# Altium schematic sheet Connector.SchDoc
size D
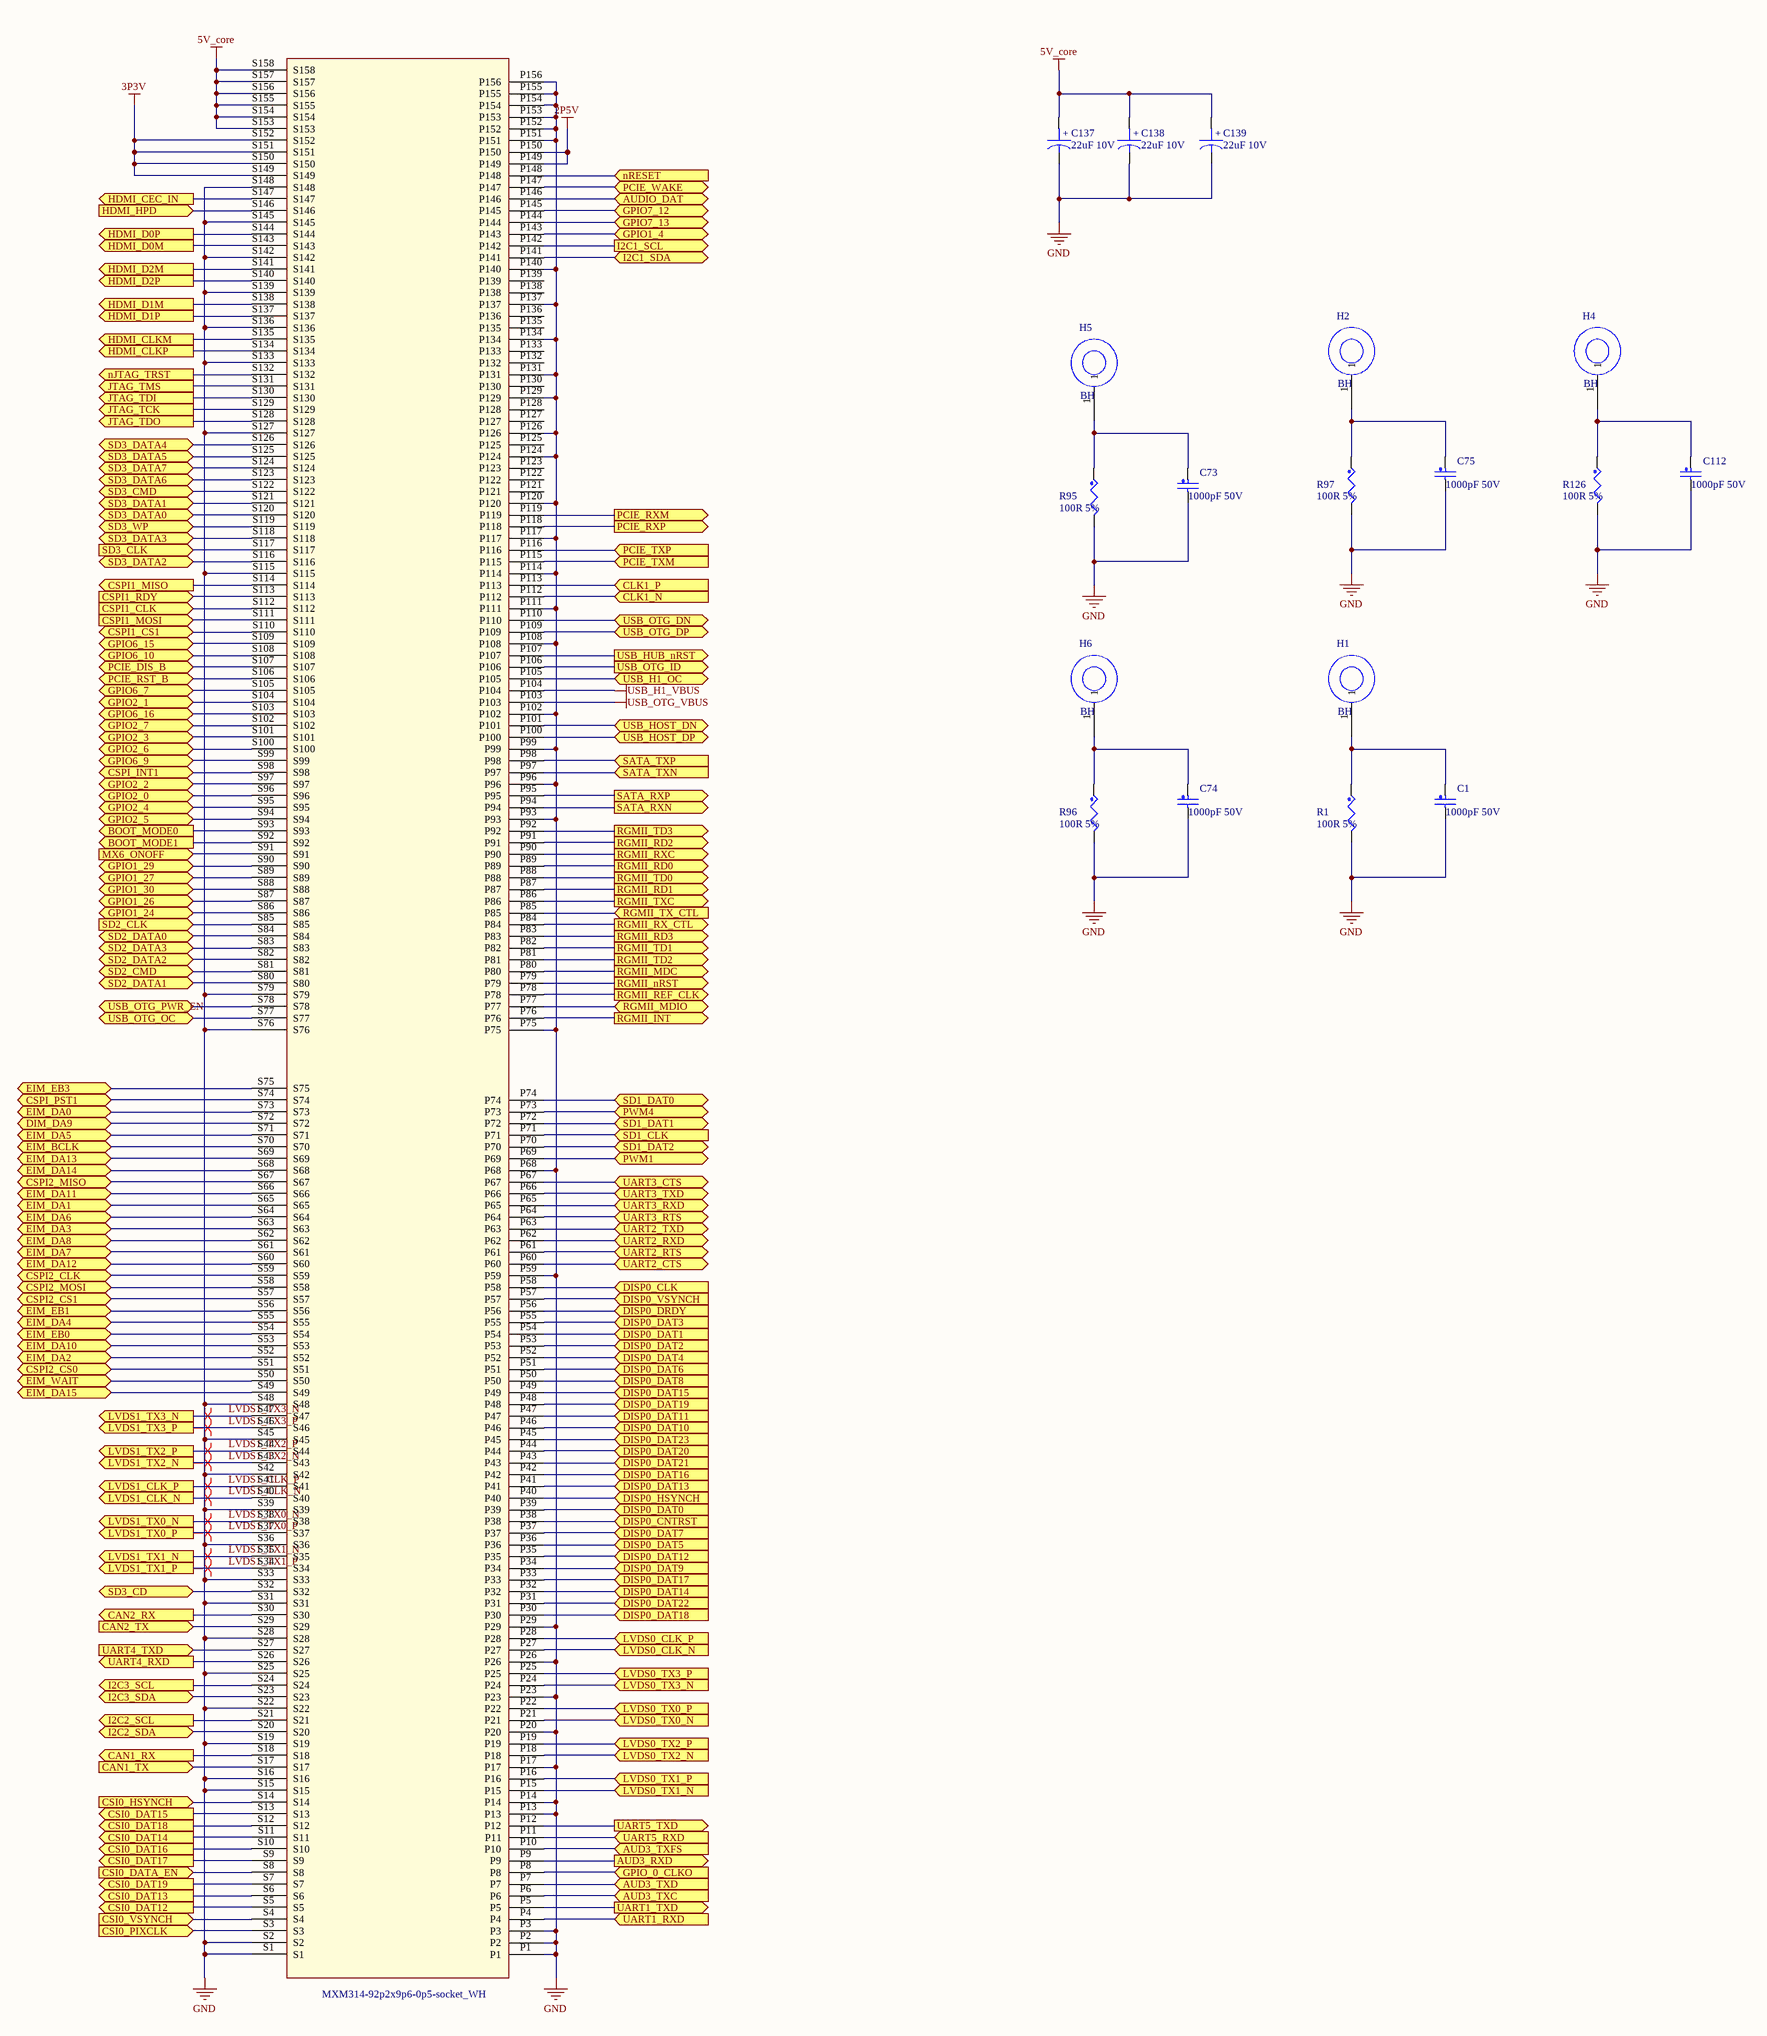
[diagram p0: Connector.SchDoc]

## Parts
C1  1000pF 50V  [SC0603]
C73  1000pF 50V  [SC0603]
C74  1000pF 50V  [SC0603]
C75  1000pF 50V  [SC0603]
C112  1000pF 50V  [SC0603]
C137  22uF 10V  [SC0805]
C138  22uF 10V  [SC0805]
C139  22uF 10V  [SC0805]
H1  BH  [H30]
H2  BH  [H30]
H4  BH  [H30]
H5  BH  [H30]
H6  BH  [H30]
MXM314-92p2x9p6-0p5-socket_WH  MXM314-92p2x9p6-0p5-socket_WH  [MXM314-92P2X9P6-0P5-SOCKET_WH]  (value not drawn)
R1  100R 5%  [SR0603]
R95  100R 5%  [SR0603]
R96  100R 5%  [SR0603]
R97  100R 5%  [SR0603]
R126  100R 5%  [SR0603]

## Ports
AUD3_RXD (out), AUD3_TXC (in), AUD3_TXD (in), AUD3_TXFS (in), AUDIO_DAT (bidir), BOOT_MODE0 (out), BOOT_MODE1 (out), CAN1_RX (out), CAN1_TX (in), CAN2_RX (out), CAN2_TX (in), CLK1_N (in), CLK1_P (in), CSI0_DAT12 (out), CSI0_DAT13 (out), CSI0_DAT14 (out), CSI0_DAT15 (out), CSI0_DAT16 (out), CSI0_DAT17 (out), CSI0_DAT18 (out), CSI0_DAT19 (out), CSI0_DATA_EN (in), CSI0_HSYNCH (in), CSI0_PIXCLK (in), CSI0_VSYNCH (in), CSPI1_CLK (in), CSPI1_CS1 (bidir), CSPI1_MISO (out), CSPI1_MOSI (in), CSPI1_RDY (in), CSPI2_CLK (bidir), CSPI2_CS0 (bidir), CSPI2_CS1 (bidir), CSPI2_MISO (bidir), CSPI2_MOSI (bidir), CSPI_INT1 (bidir), CSPI_PST1 (bidir), DIM_DA9 (bidir), DISP0_CLK (in), DISP0_CNTRST (in), DISP0_DAT0 (in), DISP0_DAT1 (in), DISP0_DAT2 (in), DISP0_DAT3 (in), DISP0_DAT4 (in), DISP0_DAT5 (in), DISP0_DAT6 (in), DISP0_DAT7 (in), DISP0_DAT8 (in), DISP0_DAT9 (in), DISP0_DAT10 (in), DISP0_DAT11 (in), DISP0_DAT12 (in), DISP0_DAT13 (in), DISP0_DAT14 (in), DISP0_DAT15 (in), DISP0_DAT16 (in), DISP0_DAT17 (in), DISP0_DAT18 (in), DISP0_DAT19 (in), DISP0_DAT20 (in), DISP0_DAT21 (in), DISP0_DAT22 (in), DISP0_DAT23 (in), DISP0_DRDY (in), DISP0_HSYNCH (in), DISP0_VSYNCH (in), EIM_BCLK (bidir), EIM_DA0 (bidir), EIM_DA1 (bidir), EIM_DA2 (bidir), EIM_DA3 (bidir), EIM_DA4 (bidir), EIM_DA5 (bidir), EIM_DA6 (bidir), EIM_DA7 (bidir), EIM_DA8 (bidir), EIM_DA10 (bidir), EIM_DA11 (bidir), EIM_DA12 (bidir), EIM_DA13 (bidir), EIM_DA14 (bidir), EIM_DA15 (bidir), EIM_EB0 (bidir), EIM_EB1 (bidir), EIM_EB3 (bidir), EIM_WAIT (bidir), GPIO1_4 (bidir), GPIO1_24 (bidir), GPIO1_26 (bidir), GPIO1_27 (bidir), GPIO1_29 (bidir), GPIO1_30 (bidir), GPIO2_0 (bidir), GPIO2_1 (bidir), GPIO2_2 (bidir), GPIO2_3 (bidir), GPIO2_4 (bidir), GPIO2_5 (bidir), GPIO2_6 (bidir), GPIO2_7 (bidir), GPIO6_7 (bidir), GPIO6_9 (bidir), GPIO6_10 (bidir), GPIO6_15 (bidir), GPIO6_16 (bidir), GPIO7_12 (bidir), GPIO7_13 (bidir), GPIO_0_CLKO (in), HDMI_CEC_IN (out), HDMI_CLKM (out), HDMI_CLKP (out), HDMI_D0M (out), HDMI_D0P (out), HDMI_D1M (out), HDMI_D1P (out), HDMI_D2M (out), HDMI_D2P (out), HDMI_HPD (in), I2C1_SCL (out), I2C1_SDA (bidir), I2C2_SCL (out), I2C2_SDA (bidir), I2C3_SCL (out), I2C3_SDA (bidir), JTAG_TCK (out), JTAG_TDI (out), JTAG_TDO (out), JTAG_TMS (out), LVDS0_CLK_N (in), LVDS0_CLK_P (in), LVDS0_TX0_N (in), LVDS0_TX0_P (in), LVDS0_TX1_N (in), LVDS0_TX1_P (in), LVDS0_TX2_N (in), LVDS0_TX2_P (in), LVDS0_TX3_N (in), LVDS0_TX3_P (in), LVDS1_CLK_N (out), LVDS1_CLK_P (out), LVDS1_TX0_N (out), LVDS1_TX0_P (out), LVDS1_TX1_N (out), LVDS1_TX1_P (out), LVDS1_TX2_N (out), LVDS1_TX2_P (out), LVDS1_TX3_N (out), LVDS1_TX3_P (out), MX6_ONOFF (in), nJTAG_TRST (out), nRESET (in), PCIE_DIS_B (bidir), PCIE_RST_B (bidir), PCIE_RXM (out), PCIE_RXP (out), PCIE_TXM (in), PCIE_TXP (in), PCIE_WAKE (bidir), PWM1 (bidir), PWM4 (bidir), RGMII_INT (out), RGMII_MDC (out), RGMII_MDIO (bidir), RGMII_nRST (out), RGMII_RD0 (out), RGMII_RD1 (out), RGMII_RD2 (out), RGMII_RD3 (out), RGMII_REF_CLK (out), RGMII_RX_CTL (out), RGMII_RXC (out), RGMII_TD0 (out), RGMII_TD1 (out), RGMII_TD2 (out), RGMII_TD3 (out), RGMII_TX_CTL (in), RGMII_TXC (out), SATA_RXN (out), SATA_RXP (out), SATA_TXN (in), SATA_TXP (in), SD1_CLK (in), SD1_DAT0 (bidir), SD1_DAT1 (bidir), SD1_DAT2 (bidir), SD2_CLK (in), SD2_CMD (bidir), SD2_DATA0 (bidir), SD2_DATA1 (bidir), SD2_DATA2 (bidir), SD2_DATA3 (bidir), SD3_CD (bidir), SD3_CLK (in), SD3_CMD (bidir), SD3_DATA0 (bidir), SD3_DATA1 (bidir), SD3_DATA2 (bidir), SD3_DATA3 (bidir), SD3_DATA4 (bidir), SD3_DATA5 (bidir), SD3_DATA6 (bidir), SD3_DATA7 (bidir), SD3_WP (bidir), UART1_RXD (in), UART1_TXD (out), UART2_CTS (bidir), UART2_RTS (bidir), UART2_RXD (bidir), UART2_TXD (bidir), UART3_CTS (bidir), UART3_RTS (bidir), UART3_RXD (bidir), UART3_TXD (bidir), UART4_RXD (out), UART4_TXD (in), UART5_RXD (in), UART5_TXD (out), USB_H1_OC (bidir), USB_HOST_DN (bidir), USB_HOST_DP (bidir), USB_HUB_nRST (out), USB_OTG_DN (bidir), USB_OTG_DP (bidir), USB_OTG_ID (out), USB_OTG_OC (bidir), USB_OTG_PWR_EN (bidir)

## Nets
2P5V: MXM314-92p2x9p6-0p5-socket_WH.P149 MXM314-92p2x9p6-0p5-socket_WH.P150
3P3V: MXM314-92p2x9p6-0p5-socket_WH.S149 MXM314-92p2x9p6-0p5-socket_WH.S150 MXM314-92p2x9p6-0p5-socket_WH.S151 MXM314-92p2x9p6-0p5-socket_WH.S152
5V_core: C137.1 C138.1 C139.1 MXM314-92p2x9p6-0p5-socket_WH.S153 MXM314-92p2x9p6-0p5-socket_WH.S154 MXM314-92p2x9p6-0p5-socket_WH.S155 MXM314-92p2x9p6-0p5-socket_WH.S156 MXM314-92p2x9p6-0p5-socket_WH.S157 MXM314-92p2x9p6-0p5-socket_WH.S158
GND: C1.2 C73.2 C74.2 C75.2 C112.2 C137.2 C138.2 C139.2 MXM314-92p2x9p6-0p5-socket_WH.P1 MXM314-92p2x9p6-0p5-socket_WH.P2 MXM314-92p2x9p6-0p5-socket_WH.P3 MXM314-92p2x9p6-0p5-socket_WH.P13 MXM314-92p2x9p6-0p5-socket_WH.P14 MXM314-92p2x9p6-0p5-socket_WH.P17 MXM314-92p2x9p6-0p5-socket_WH.P20 MXM314-92p2x9p6-0p5-socket_WH.P23 MXM314-92p2x9p6-0p5-socket_WH.P26 MXM314-92p2x9p6-0p5-socket_WH.P29 MXM314-92p2x9p6-0p5-socket_WH.P59 MXM314-92p2x9p6-0p5-socket_WH.P68 MXM314-92p2x9p6-0p5-socket_WH.P75 MXM314-92p2x9p6-0p5-socket_WH.P93 MXM314-92p2x9p6-0p5-socket_WH.P96 MXM314-92p2x9p6-0p5-socket_WH.P99 MXM314-92p2x9p6-0p5-socket_WH.P102 MXM314-92p2x9p6-0p5-socket_WH.P108 MXM314-92p2x9p6-0p5-socket_WH.P111 MXM314-92p2x9p6-0p5-socket_WH.P114 MXM314-92p2x9p6-0p5-socket_WH.P117 MXM314-92p2x9p6-0p5-socket_WH.P120 MXM314-92p2x9p6-0p5-socket_WH.P124 MXM314-92p2x9p6-0p5-socket_WH.P126 MXM314-92p2x9p6-0p5-socket_WH.P129 MXM314-92p2x9p6-0p5-socket_WH.P131 MXM314-92p2x9p6-0p5-socket_WH.P134 MXM314-92p2x9p6-0p5-socket_WH.P137 MXM314-92p2x9p6-0p5-socket_WH.P140 MXM314-92p2x9p6-0p5-socket_WH.P151 MXM314-92p2x9p6-0p5-socket_WH.P152 MXM314-92p2x9p6-0p5-socket_WH.P153 MXM314-92p2x9p6-0p5-socket_WH.P154 MXM314-92p2x9p6-0p5-socket_WH.P155 MXM314-92p2x9p6-0p5-socket_WH.P156 MXM314-92p2x9p6-0p5-socket_WH.S1 MXM314-92p2x9p6-0p5-socket_WH.S2 MXM314-92p2x9p6-0p5-socket_WH.S15 MXM314-92p2x9p6-0p5-socket_WH.S16 MXM314-92p2x9p6-0p5-socket_WH.S19 MXM314-92p2x9p6-0p5-socket_WH.S22 MXM314-92p2x9p6-0p5-socket_WH.S25 MXM314-92p2x9p6-0p5-socket_WH.S28 MXM314-92p2x9p6-0p5-socket_WH.S31 MXM314-92p2x9p6-0p5-socket_WH.S33 MXM314-92p2x9p6-0p5-socket_WH.S36 MXM314-92p2x9p6-0p5-socket_WH.S39 MXM314-92p2x9p6-0p5-socket_WH.S42 MXM314-92p2x9p6-0p5-socket_WH.S45 MXM314-92p2x9p6-0p5-socket_WH.S48 MXM314-92p2x9p6-0p5-socket_WH.S76 MXM314-92p2x9p6-0p5-socket_WH.S79 MXM314-92p2x9p6-0p5-socket_WH.S115 MXM314-92p2x9p6-0p5-socket_WH.S127 MXM314-92p2x9p6-0p5-socket_WH.S133 MXM314-92p2x9p6-0p5-socket_WH.S136 MXM314-92p2x9p6-0p5-socket_WH.S139 MXM314-92p2x9p6-0p5-socket_WH.S142 MXM314-92p2x9p6-0p5-socket_WH.S145 MXM314-92p2x9p6-0p5-socket_WH.S148 R1.2 R95.2 R96.2 R97.2 R126.2
USB_H1_VBUS: MXM314-92p2x9p6-0p5-socket_WH.P104
USB_OTG_VBUS: MXM314-92p2x9p6-0p5-socket_WH.P103
AUD3_RXD: MXM314-92p2x9p6-0p5-socket_WH.P9 ; port AUD3_RXD
AUD3_TXC: MXM314-92p2x9p6-0p5-socket_WH.P6 ; port AUD3_TXC
AUD3_TXD: MXM314-92p2x9p6-0p5-socket_WH.P7 ; port AUD3_TXD
AUD3_TXFS: MXM314-92p2x9p6-0p5-socket_WH.P10 ; port AUD3_TXFS
AUDIO_DAT: MXM314-92p2x9p6-0p5-socket_WH.P146 ; port AUDIO_DAT
BOOT_MODE0: MXM314-92p2x9p6-0p5-socket_WH.S93 ; port BOOT_MODE0
BOOT_MODE1: MXM314-92p2x9p6-0p5-socket_WH.S92 ; port BOOT_MODE1
CAN1_RX: MXM314-92p2x9p6-0p5-socket_WH.S18 ; port CAN1_RX
CAN1_TX: MXM314-92p2x9p6-0p5-socket_WH.S17 ; port CAN1_TX
CAN2_RX: MXM314-92p2x9p6-0p5-socket_WH.S30 ; port CAN2_RX
CAN2_TX: MXM314-92p2x9p6-0p5-socket_WH.S29 ; port CAN2_TX
CLK1_N: MXM314-92p2x9p6-0p5-socket_WH.P112 ; port CLK1_N
CLK1_P: MXM314-92p2x9p6-0p5-socket_WH.P113 ; port CLK1_P
CSI0_DAT12: MXM314-92p2x9p6-0p5-socket_WH.S5 ; port CSI0_DAT12
CSI0_DAT13: MXM314-92p2x9p6-0p5-socket_WH.S6 ; port CSI0_DAT13
CSI0_DAT14: MXM314-92p2x9p6-0p5-socket_WH.S11 ; port CSI0_DAT14
CSI0_DAT15: MXM314-92p2x9p6-0p5-socket_WH.S13 ; port CSI0_DAT15
CSI0_DAT16: MXM314-92p2x9p6-0p5-socket_WH.S10 ; port CSI0_DAT16
CSI0_DAT17: MXM314-92p2x9p6-0p5-socket_WH.S9 ; port CSI0_DAT17
CSI0_DAT18: MXM314-92p2x9p6-0p5-socket_WH.S12 ; port CSI0_DAT18
CSI0_DAT19: MXM314-92p2x9p6-0p5-socket_WH.S7 ; port CSI0_DAT19
CSI0_DATA_EN: MXM314-92p2x9p6-0p5-socket_WH.S8 ; port CSI0_DATA_EN
CSI0_HSYNCH: MXM314-92p2x9p6-0p5-socket_WH.S14 ; port CSI0_HSYNCH
CSI0_PIXCLK: MXM314-92p2x9p6-0p5-socket_WH.S3 ; port CSI0_PIXCLK
CSI0_VSYNCH: MXM314-92p2x9p6-0p5-socket_WH.S4 ; port CSI0_VSYNCH
CSPI1_CLK: MXM314-92p2x9p6-0p5-socket_WH.S112 ; port CSPI1_CLK
CSPI1_CS1: MXM314-92p2x9p6-0p5-socket_WH.S110 ; port CSPI1_CS1
CSPI1_MISO: MXM314-92p2x9p6-0p5-socket_WH.S114 ; port CSPI1_MISO
CSPI1_MOSI: MXM314-92p2x9p6-0p5-socket_WH.S111 ; port CSPI1_MOSI
CSPI1_RDY: MXM314-92p2x9p6-0p5-socket_WH.S113 ; port CSPI1_RDY
CSPI2_CLK: MXM314-92p2x9p6-0p5-socket_WH.S59 ; port CSPI2_CLK
CSPI2_CS0: MXM314-92p2x9p6-0p5-socket_WH.S51 ; port CSPI2_CS0
CSPI2_CS1: MXM314-92p2x9p6-0p5-socket_WH.S57 ; port CSPI2_CS1
CSPI2_MISO: MXM314-92p2x9p6-0p5-socket_WH.S67 ; port CSPI2_MISO
CSPI2_MOSI: MXM314-92p2x9p6-0p5-socket_WH.S58 ; port CSPI2_MOSI
CSPI_INT1: MXM314-92p2x9p6-0p5-socket_WH.S98 ; port CSPI_INT1
CSPI_PST1: MXM314-92p2x9p6-0p5-socket_WH.S74 ; port CSPI_PST1
DIM_DA9: MXM314-92p2x9p6-0p5-socket_WH.S72 ; port DIM_DA9
DISP0_CLK: MXM314-92p2x9p6-0p5-socket_WH.P58 ; port DISP0_CLK
DISP0_CNTRST: MXM314-92p2x9p6-0p5-socket_WH.P38 ; port DISP0_CNTRST
DISP0_DAT0: MXM314-92p2x9p6-0p5-socket_WH.P39 ; port DISP0_DAT0
DISP0_DAT1: MXM314-92p2x9p6-0p5-socket_WH.P54 ; port DISP0_DAT1
DISP0_DAT2: MXM314-92p2x9p6-0p5-socket_WH.P53 ; port DISP0_DAT2
DISP0_DAT3: MXM314-92p2x9p6-0p5-socket_WH.P55 ; port DISP0_DAT3
DISP0_DAT4: MXM314-92p2x9p6-0p5-socket_WH.P52 ; port DISP0_DAT4
DISP0_DAT5: MXM314-92p2x9p6-0p5-socket_WH.P36 ; port DISP0_DAT5
DISP0_DAT6: MXM314-92p2x9p6-0p5-socket_WH.P51 ; port DISP0_DAT6
DISP0_DAT7: MXM314-92p2x9p6-0p5-socket_WH.P37 ; port DISP0_DAT7
DISP0_DAT8: MXM314-92p2x9p6-0p5-socket_WH.P50 ; port DISP0_DAT8
DISP0_DAT9: MXM314-92p2x9p6-0p5-socket_WH.P34 ; port DISP0_DAT9
DISP0_DAT10: MXM314-92p2x9p6-0p5-socket_WH.P46 ; port DISP0_DAT10
DISP0_DAT11: MXM314-92p2x9p6-0p5-socket_WH.P47 ; port DISP0_DAT11
DISP0_DAT12: MXM314-92p2x9p6-0p5-socket_WH.P35 ; port DISP0_DAT12
DISP0_DAT13: MXM314-92p2x9p6-0p5-socket_WH.P41 ; port DISP0_DAT13
DISP0_DAT14: MXM314-92p2x9p6-0p5-socket_WH.P32 ; port DISP0_DAT14
DISP0_DAT15: MXM314-92p2x9p6-0p5-socket_WH.P49 ; port DISP0_DAT15
DISP0_DAT16: MXM314-92p2x9p6-0p5-socket_WH.P42 ; port DISP0_DAT16
DISP0_DAT17: MXM314-92p2x9p6-0p5-socket_WH.P33 ; port DISP0_DAT17
DISP0_DAT18: MXM314-92p2x9p6-0p5-socket_WH.P30 ; port DISP0_DAT18
DISP0_DAT19: MXM314-92p2x9p6-0p5-socket_WH.P48 ; port DISP0_DAT19
DISP0_DAT20: MXM314-92p2x9p6-0p5-socket_WH.P44 ; port DISP0_DAT20
DISP0_DAT21: MXM314-92p2x9p6-0p5-socket_WH.P43 ; port DISP0_DAT21
DISP0_DAT22: MXM314-92p2x9p6-0p5-socket_WH.P31 ; port DISP0_DAT22
DISP0_DAT23: MXM314-92p2x9p6-0p5-socket_WH.P45 ; port DISP0_DAT23
DISP0_DRDY: MXM314-92p2x9p6-0p5-socket_WH.P56 ; port DISP0_DRDY
DISP0_HSYNCH: MXM314-92p2x9p6-0p5-socket_WH.P40 ; port DISP0_HSYNCH
DISP0_VSYNCH: MXM314-92p2x9p6-0p5-socket_WH.P57 ; port DISP0_VSYNCH
EIM_BCLK: MXM314-92p2x9p6-0p5-socket_WH.S70 ; port EIM_BCLK
EIM_DA0: MXM314-92p2x9p6-0p5-socket_WH.S73 ; port EIM_DA0
EIM_DA1: MXM314-92p2x9p6-0p5-socket_WH.S65 ; port EIM_DA1
EIM_DA2: MXM314-92p2x9p6-0p5-socket_WH.S52 ; port EIM_DA2
EIM_DA3: MXM314-92p2x9p6-0p5-socket_WH.S63 ; port EIM_DA3
EIM_DA4: MXM314-92p2x9p6-0p5-socket_WH.S55 ; port EIM_DA4
EIM_DA5: MXM314-92p2x9p6-0p5-socket_WH.S71 ; port EIM_DA5
EIM_DA6: MXM314-92p2x9p6-0p5-socket_WH.S64 ; port EIM_DA6
EIM_DA7: MXM314-92p2x9p6-0p5-socket_WH.S61 ; port EIM_DA7
EIM_DA8: MXM314-92p2x9p6-0p5-socket_WH.S62 ; port EIM_DA8
EIM_DA10: MXM314-92p2x9p6-0p5-socket_WH.S53 ; port EIM_DA10
EIM_DA11: MXM314-92p2x9p6-0p5-socket_WH.S66 ; port EIM_DA11
EIM_DA12: MXM314-92p2x9p6-0p5-socket_WH.S60 ; port EIM_DA12
EIM_DA13: MXM314-92p2x9p6-0p5-socket_WH.S69 ; port EIM_DA13
EIM_DA14: MXM314-92p2x9p6-0p5-socket_WH.S68 ; port EIM_DA14
EIM_DA15: MXM314-92p2x9p6-0p5-socket_WH.S49 ; port EIM_DA15
EIM_EB0: MXM314-92p2x9p6-0p5-socket_WH.S54 ; port EIM_EB0
EIM_EB1: MXM314-92p2x9p6-0p5-socket_WH.S56 ; port EIM_EB1
EIM_EB3: MXM314-92p2x9p6-0p5-socket_WH.S75 ; port EIM_EB3
EIM_WAIT: MXM314-92p2x9p6-0p5-socket_WH.S50 ; port EIM_WAIT
GPIO1_4: MXM314-92p2x9p6-0p5-socket_WH.P143 ; port GPIO1_4
GPIO1_24: MXM314-92p2x9p6-0p5-socket_WH.S86 ; port GPIO1_24
GPIO1_26: MXM314-92p2x9p6-0p5-socket_WH.S87 ; port GPIO1_26
GPIO1_27: MXM314-92p2x9p6-0p5-socket_WH.S89 ; port GPIO1_27
GPIO1_29: MXM314-92p2x9p6-0p5-socket_WH.S90 ; port GPIO1_29
GPIO1_30: MXM314-92p2x9p6-0p5-socket_WH.S88 ; port GPIO1_30
GPIO2_0: MXM314-92p2x9p6-0p5-socket_WH.S96 ; port GPIO2_0
GPIO2_1: MXM314-92p2x9p6-0p5-socket_WH.S104 ; port GPIO2_1
GPIO2_2: MXM314-92p2x9p6-0p5-socket_WH.S97 ; port GPIO2_2
GPIO2_3: MXM314-92p2x9p6-0p5-socket_WH.S101 ; port GPIO2_3
GPIO2_4: MXM314-92p2x9p6-0p5-socket_WH.S95 ; port GPIO2_4
GPIO2_5: MXM314-92p2x9p6-0p5-socket_WH.S94 ; port GPIO2_5
GPIO2_6: MXM314-92p2x9p6-0p5-socket_WH.S100 ; port GPIO2_6
GPIO2_7: MXM314-92p2x9p6-0p5-socket_WH.S102 ; port GPIO2_7
GPIO6_7: MXM314-92p2x9p6-0p5-socket_WH.S105 ; port GPIO6_7
GPIO6_9: MXM314-92p2x9p6-0p5-socket_WH.S99 ; port GPIO6_9
GPIO6_10: MXM314-92p2x9p6-0p5-socket_WH.S108 ; port GPIO6_10
GPIO6_15: MXM314-92p2x9p6-0p5-socket_WH.S109 ; port GPIO6_15
GPIO6_16: MXM314-92p2x9p6-0p5-socket_WH.S103 ; port GPIO6_16
GPIO7_12: MXM314-92p2x9p6-0p5-socket_WH.P145 ; port GPIO7_12
GPIO7_13: MXM314-92p2x9p6-0p5-socket_WH.P144 ; port GPIO7_13
GPIO_0_CLKO: MXM314-92p2x9p6-0p5-socket_WH.P8 ; port GPIO_0_CLKO
HDMI_CEC_IN: MXM314-92p2x9p6-0p5-socket_WH.S147 ; port HDMI_CEC_IN
HDMI_CLKM: MXM314-92p2x9p6-0p5-socket_WH.S135 ; port HDMI_CLKM
HDMI_CLKP: MXM314-92p2x9p6-0p5-socket_WH.S134 ; port HDMI_CLKP
HDMI_D0M: MXM314-92p2x9p6-0p5-socket_WH.S143 ; port HDMI_D0M
HDMI_D0P: MXM314-92p2x9p6-0p5-socket_WH.S144 ; port HDMI_D0P
HDMI_D1M: MXM314-92p2x9p6-0p5-socket_WH.S138 ; port HDMI_D1M
HDMI_D1P: MXM314-92p2x9p6-0p5-socket_WH.S137 ; port HDMI_D1P
HDMI_D2M: MXM314-92p2x9p6-0p5-socket_WH.S141 ; port HDMI_D2M
HDMI_D2P: MXM314-92p2x9p6-0p5-socket_WH.S140 ; port HDMI_D2P
HDMI_HPD: MXM314-92p2x9p6-0p5-socket_WH.S146 ; port HDMI_HPD
I2C1_SCL: MXM314-92p2x9p6-0p5-socket_WH.P142 ; port I2C1_SCL
I2C1_SDA: MXM314-92p2x9p6-0p5-socket_WH.P141 ; port I2C1_SDA
I2C2_SCL: MXM314-92p2x9p6-0p5-socket_WH.S21 ; port I2C2_SCL
I2C2_SDA: MXM314-92p2x9p6-0p5-socket_WH.S20 ; port I2C2_SDA
I2C3_SCL: MXM314-92p2x9p6-0p5-socket_WH.S24 ; port I2C3_SCL
I2C3_SDA: MXM314-92p2x9p6-0p5-socket_WH.S23 ; port I2C3_SDA
JTAG_TCK: MXM314-92p2x9p6-0p5-socket_WH.S129 ; port JTAG_TCK
JTAG_TDI: MXM314-92p2x9p6-0p5-socket_WH.S130 ; port JTAG_TDI
JTAG_TDO: MXM314-92p2x9p6-0p5-socket_WH.S128 ; port JTAG_TDO
JTAG_TMS: MXM314-92p2x9p6-0p5-socket_WH.S131 ; port JTAG_TMS
LVDS0_CLK_N: MXM314-92p2x9p6-0p5-socket_WH.P27 ; port LVDS0_CLK_N
LVDS0_CLK_P: MXM314-92p2x9p6-0p5-socket_WH.P28 ; port LVDS0_CLK_P
LVDS0_TX0_N: MXM314-92p2x9p6-0p5-socket_WH.P21 ; port LVDS0_TX0_N
LVDS0_TX0_P: MXM314-92p2x9p6-0p5-socket_WH.P22 ; port LVDS0_TX0_P
LVDS0_TX1_N: MXM314-92p2x9p6-0p5-socket_WH.P15 ; port LVDS0_TX1_N
LVDS0_TX1_P: MXM314-92p2x9p6-0p5-socket_WH.P16 ; port LVDS0_TX1_P
LVDS0_TX2_N: MXM314-92p2x9p6-0p5-socket_WH.P18 ; port LVDS0_TX2_N
LVDS0_TX2_P: MXM314-92p2x9p6-0p5-socket_WH.P19 ; port LVDS0_TX2_P
LVDS0_TX3_N: MXM314-92p2x9p6-0p5-socket_WH.P24 ; port LVDS0_TX3_N
LVDS0_TX3_P: MXM314-92p2x9p6-0p5-socket_WH.P25 ; port LVDS0_TX3_P
LVDS1_CLK_N: MXM314-92p2x9p6-0p5-socket_WH.S40 ; port LVDS1_CLK_N
LVDS1_CLK_P: MXM314-92p2x9p6-0p5-socket_WH.S41 ; port LVDS1_CLK_P
LVDS1_TX0_N: MXM314-92p2x9p6-0p5-socket_WH.S38 ; port LVDS1_TX0_N
LVDS1_TX0_P: MXM314-92p2x9p6-0p5-socket_WH.S37 ; port LVDS1_TX0_P
LVDS1_TX1_N: MXM314-92p2x9p6-0p5-socket_WH.S35 ; port LVDS1_TX1_N
LVDS1_TX1_P: MXM314-92p2x9p6-0p5-socket_WH.S34 ; port LVDS1_TX1_P
LVDS1_TX2_N: MXM314-92p2x9p6-0p5-socket_WH.S43 ; port LVDS1_TX2_N
LVDS1_TX2_P: MXM314-92p2x9p6-0p5-socket_WH.S44 ; port LVDS1_TX2_P
LVDS1_TX3_N: MXM314-92p2x9p6-0p5-socket_WH.S47 ; port LVDS1_TX3_N
LVDS1_TX3_P: MXM314-92p2x9p6-0p5-socket_WH.S46 ; port LVDS1_TX3_P
MX6_ONOFF: MXM314-92p2x9p6-0p5-socket_WH.S91 ; port MX6_ONOFF
nJTAG_TRST: MXM314-92p2x9p6-0p5-socket_WH.S132 ; port nJTAG_TRST
nRESET: MXM314-92p2x9p6-0p5-socket_WH.P148 ; port nRESET
PCIE_DIS_B: MXM314-92p2x9p6-0p5-socket_WH.S107 ; port PCIE_DIS_B
PCIE_RST_B: MXM314-92p2x9p6-0p5-socket_WH.S106 ; port PCIE_RST_B
PCIE_RXM: MXM314-92p2x9p6-0p5-socket_WH.P119 ; port PCIE_RXM
PCIE_RXP: MXM314-92p2x9p6-0p5-socket_WH.P118 ; port PCIE_RXP
PCIE_TXM: MXM314-92p2x9p6-0p5-socket_WH.P115 ; port PCIE_TXM
PCIE_TXP: MXM314-92p2x9p6-0p5-socket_WH.P116 ; port PCIE_TXP
PCIE_WAKE: MXM314-92p2x9p6-0p5-socket_WH.P147 ; port PCIE_WAKE
PWM1: MXM314-92p2x9p6-0p5-socket_WH.P69 ; port PWM1
PWM4: MXM314-92p2x9p6-0p5-socket_WH.P73 ; port PWM4
RGMII_INT: MXM314-92p2x9p6-0p5-socket_WH.P76 ; port RGMII_INT
RGMII_MDC: MXM314-92p2x9p6-0p5-socket_WH.P80 ; port RGMII_MDC
RGMII_MDIO: MXM314-92p2x9p6-0p5-socket_WH.P77 ; port RGMII_MDIO
RGMII_nRST: MXM314-92p2x9p6-0p5-socket_WH.P79 ; port RGMII_nRST
RGMII_RD0: MXM314-92p2x9p6-0p5-socket_WH.P89 ; port RGMII_RD0
RGMII_RD1: MXM314-92p2x9p6-0p5-socket_WH.P87 ; port RGMII_RD1
RGMII_RD2: MXM314-92p2x9p6-0p5-socket_WH.P91 ; port RGMII_RD2
RGMII_RD3: MXM314-92p2x9p6-0p5-socket_WH.P83 ; port RGMII_RD3
RGMII_REF_CLK: MXM314-92p2x9p6-0p5-socket_WH.P78 ; port RGMII_REF_CLK
RGMII_RX_CTL: MXM314-92p2x9p6-0p5-socket_WH.P84 ; port RGMII_RX_CTL
RGMII_RXC: MXM314-92p2x9p6-0p5-socket_WH.P90 ; port RGMII_RXC
RGMII_TD0: MXM314-92p2x9p6-0p5-socket_WH.P88 ; port RGMII_TD0
RGMII_TD1: MXM314-92p2x9p6-0p5-socket_WH.P82 ; port RGMII_TD1
RGMII_TD2: MXM314-92p2x9p6-0p5-socket_WH.P81 ; port RGMII_TD2
RGMII_TD3: MXM314-92p2x9p6-0p5-socket_WH.P92 ; port RGMII_TD3
RGMII_TX_CTL: MXM314-92p2x9p6-0p5-socket_WH.P85 ; port RGMII_TX_CTL
RGMII_TXC: MXM314-92p2x9p6-0p5-socket_WH.P86 ; port RGMII_TXC
SATA_RXN: MXM314-92p2x9p6-0p5-socket_WH.P94 ; port SATA_RXN
SATA_RXP: MXM314-92p2x9p6-0p5-socket_WH.P95 ; port SATA_RXP
SATA_TXN: MXM314-92p2x9p6-0p5-socket_WH.P97 ; port SATA_TXN
SATA_TXP: MXM314-92p2x9p6-0p5-socket_WH.P98 ; port SATA_TXP
SD1_CLK: MXM314-92p2x9p6-0p5-socket_WH.P71 ; port SD1_CLK
SD1_DAT0: MXM314-92p2x9p6-0p5-socket_WH.P74 ; port SD1_DAT0
SD1_DAT1: MXM314-92p2x9p6-0p5-socket_WH.P72 ; port SD1_DAT1
SD1_DAT2: MXM314-92p2x9p6-0p5-socket_WH.P70 ; port SD1_DAT2
SD2_CLK: MXM314-92p2x9p6-0p5-socket_WH.S85 ; port SD2_CLK
SD2_CMD: MXM314-92p2x9p6-0p5-socket_WH.S81 ; port SD2_CMD
SD2_DATA0: MXM314-92p2x9p6-0p5-socket_WH.S84 ; port SD2_DATA0
SD2_DATA1: MXM314-92p2x9p6-0p5-socket_WH.S80 ; port SD2_DATA1
SD2_DATA2: MXM314-92p2x9p6-0p5-socket_WH.S82 ; port SD2_DATA2
SD2_DATA3: MXM314-92p2x9p6-0p5-socket_WH.S83 ; port SD2_DATA3
SD3_CD: MXM314-92p2x9p6-0p5-socket_WH.S32 ; port SD3_CD
SD3_CLK: MXM314-92p2x9p6-0p5-socket_WH.S117 ; port SD3_CLK
SD3_CMD: MXM314-92p2x9p6-0p5-socket_WH.S122 ; port SD3_CMD
SD3_DATA0: MXM314-92p2x9p6-0p5-socket_WH.S120 ; port SD3_DATA0
SD3_DATA1: MXM314-92p2x9p6-0p5-socket_WH.S121 ; port SD3_DATA1
SD3_DATA2: MXM314-92p2x9p6-0p5-socket_WH.S116 ; port SD3_DATA2
SD3_DATA3: MXM314-92p2x9p6-0p5-socket_WH.S118 ; port SD3_DATA3
SD3_DATA4: MXM314-92p2x9p6-0p5-socket_WH.S126 ; port SD3_DATA4
SD3_DATA5: MXM314-92p2x9p6-0p5-socket_WH.S125 ; port SD3_DATA5
SD3_DATA6: MXM314-92p2x9p6-0p5-socket_WH.S123 ; port SD3_DATA6
SD3_DATA7: MXM314-92p2x9p6-0p5-socket_WH.S124 ; port SD3_DATA7
SD3_WP: MXM314-92p2x9p6-0p5-socket_WH.S119 ; port SD3_WP
UART1_RXD: MXM314-92p2x9p6-0p5-socket_WH.P4 ; port UART1_RXD
UART1_TXD: MXM314-92p2x9p6-0p5-socket_WH.P5 ; port UART1_TXD
UART2_CTS: MXM314-92p2x9p6-0p5-socket_WH.P60 ; port UART2_CTS
UART2_RTS: MXM314-92p2x9p6-0p5-socket_WH.P61 ; port UART2_RTS
UART2_RXD: MXM314-92p2x9p6-0p5-socket_WH.P62 ; port UART2_RXD
UART2_TXD: MXM314-92p2x9p6-0p5-socket_WH.P63 ; port UART2_TXD
UART3_CTS: MXM314-92p2x9p6-0p5-socket_WH.P67 ; port UART3_CTS
UART3_RTS: MXM314-92p2x9p6-0p5-socket_WH.P64 ; port UART3_RTS
UART3_RXD: MXM314-92p2x9p6-0p5-socket_WH.P65 ; port UART3_RXD
UART3_TXD: MXM314-92p2x9p6-0p5-socket_WH.P66 ; port UART3_TXD
UART4_RXD: MXM314-92p2x9p6-0p5-socket_WH.S26 ; port UART4_RXD
UART4_TXD: MXM314-92p2x9p6-0p5-socket_WH.S27 ; port UART4_TXD
UART5_RXD: MXM314-92p2x9p6-0p5-socket_WH.P11 ; port UART5_RXD
UART5_TXD: MXM314-92p2x9p6-0p5-socket_WH.P12 ; port UART5_TXD
USB_H1_OC: MXM314-92p2x9p6-0p5-socket_WH.P105 ; port USB_H1_OC
USB_HOST_DN: MXM314-92p2x9p6-0p5-socket_WH.P101 ; port USB_HOST_DN
USB_HOST_DP: MXM314-92p2x9p6-0p5-socket_WH.P100 ; port USB_HOST_DP
USB_HUB_nRST: MXM314-92p2x9p6-0p5-socket_WH.P107 ; port USB_HUB_nRST
USB_OTG_DN: MXM314-92p2x9p6-0p5-socket_WH.P110 ; port USB_OTG_DN
USB_OTG_DP: MXM314-92p2x9p6-0p5-socket_WH.P109 ; port USB_OTG_DP
USB_OTG_ID: MXM314-92p2x9p6-0p5-socket_WH.P106 ; port USB_OTG_ID
USB_OTG_OC: MXM314-92p2x9p6-0p5-socket_WH.S77 ; port USB_OTG_OC
USB_OTG_PWR_EN: MXM314-92p2x9p6-0p5-socket_WH.S78 ; port USB_OTG_PWR_EN
NetC1_1: C1.1 H1.1 R1.1
NetC73_1: C73.1 H5.1 R95.1
NetC74_1: C74.1 H6.1 R96.1
NetC75_1: C75.1 H2.1 R97.1
NetC112_1: C112.1 H4.1 R126.1

Not connected (* = marked no-connect by the designer): MXM314-92p2x9p6-0p5-socket_WH P121 P122 P123 P125 P127 P128 P130 P132 P133 P135 P136 P138 P139

## Layout directives
differential pair: LVDS1_CLK_N, LVDS1_CLK_P, LVDS1_TX0_N, LVDS1_TX0_P, LVDS1_TX1_N, LVDS1_TX1_P, LVDS1_TX2_N, LVDS1_TX2_P, LVDS1_TX3_N, LVDS1_TX3_P

## Notes on the sheet
- (in symbol CAP POL) +

## Library data of the parts
C1 C73-C75 C112 = CAP_NP: CLASS: DISCRETE
C137-C139 = CAP POL
MXM314-92p2x9p6-0p5-socket_WH = MXM314
R1 R95-R97 R126 = RES: CLASS: DISCRETE